# EAGLE design LINLCDV2 (EAGLE 9.5.2)
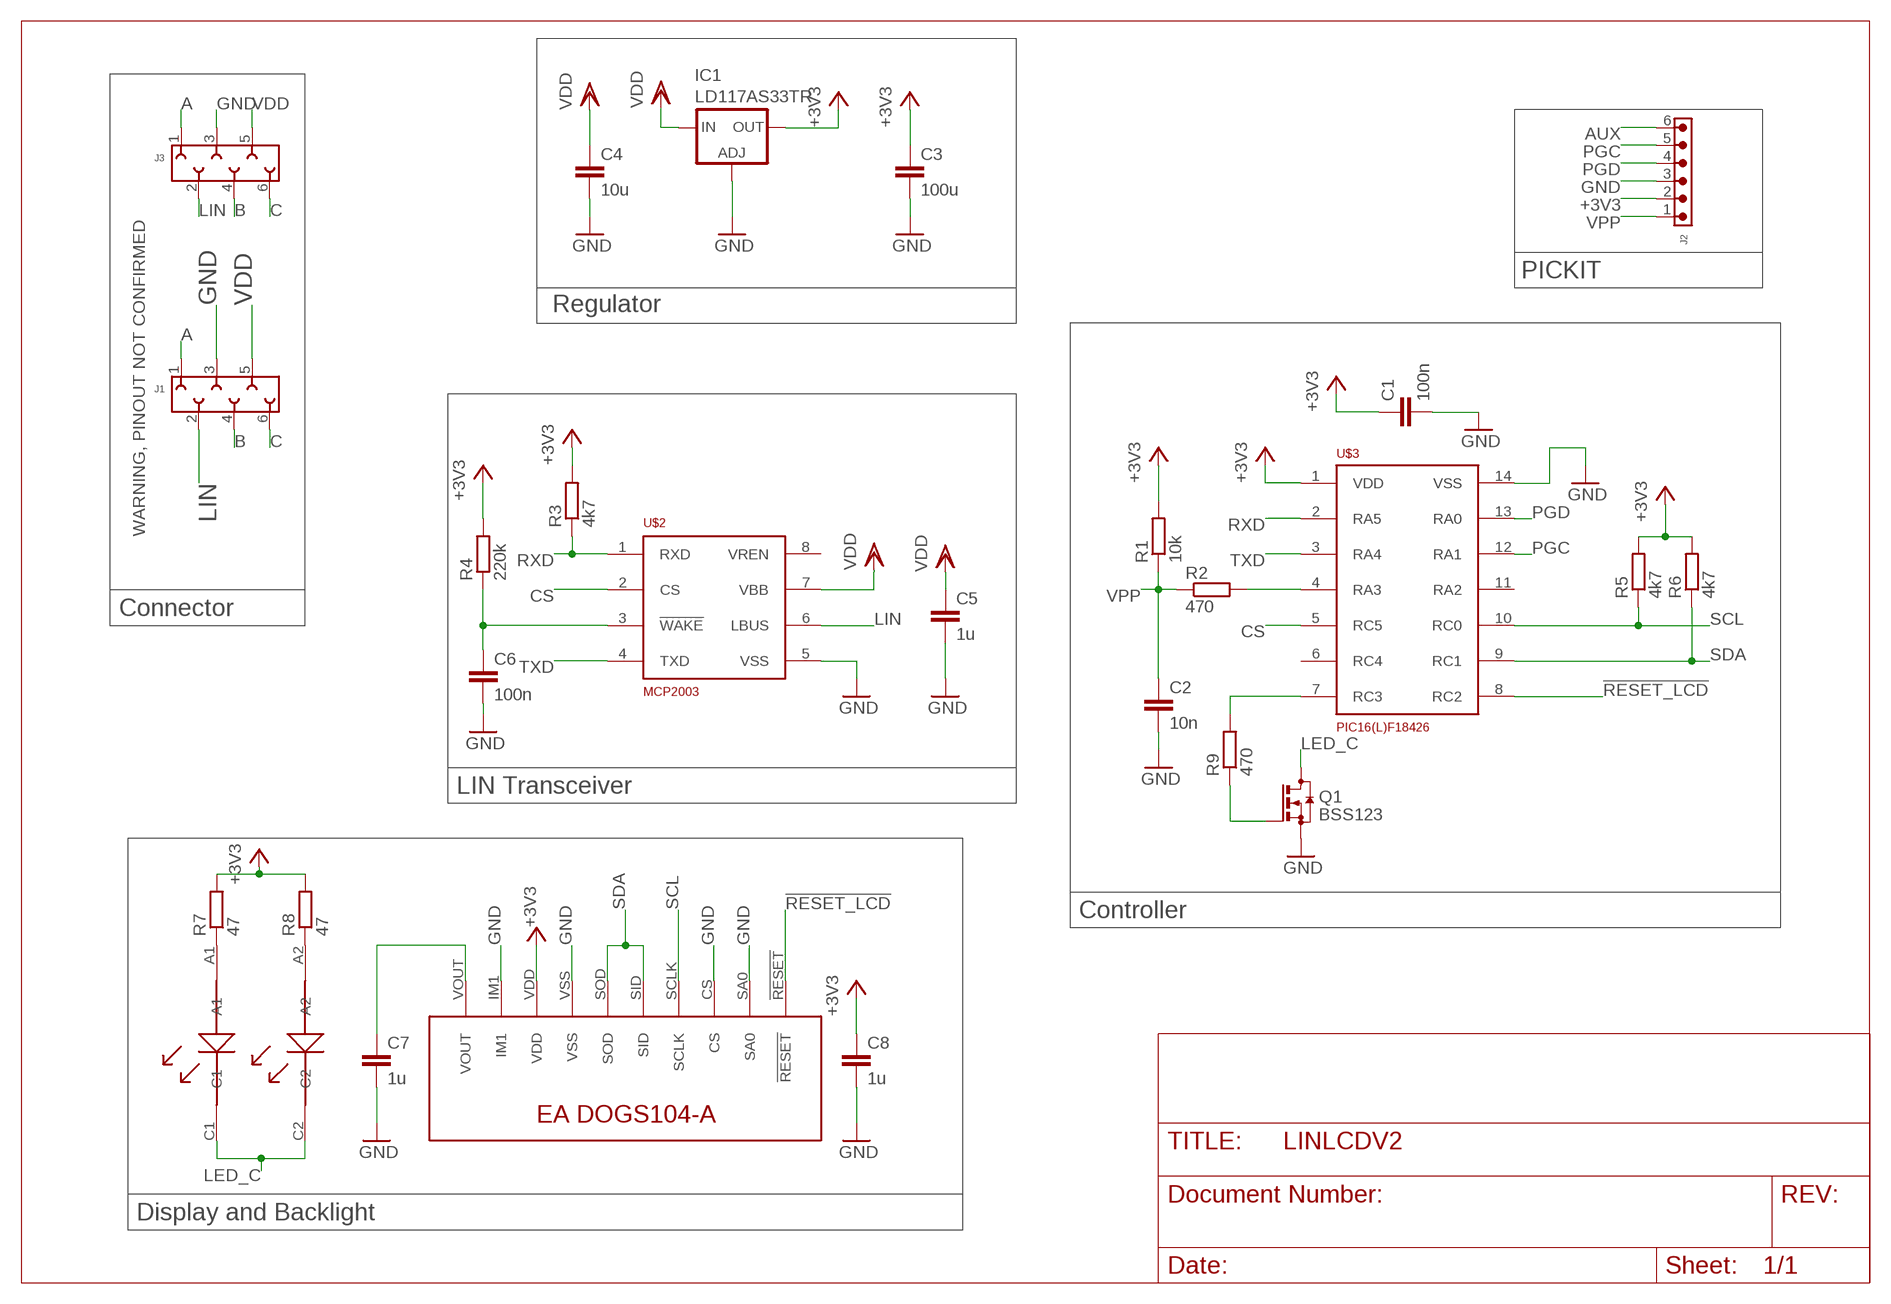
[diagram p0: schematic, sheet 1]

## Parts
C1  100n  C-EUC0603  [C0603]
C2  10n  C-EUC0603  [C0603]
C3  100u  C-EUC1206  [C1206]
C4  10u  C-EUC1206  [C1206]
C5  1u  C-EUC1206  [C1206]
C6  100n  C-EUC0603  [C0603]
C7  1u  C-EUC1206  [C1206]
C8  1u  C-EUC1206  [C1206]
IC1  LD117AS33TR  [SOT223]
J1  690367280676  [690367280676]
J2  6130XX11021_61300611021  [61300611021]
J3  690367280676  [690367280676]
Q1  BSS123  [SOT23]
R1  10k  R-EU_R0603  [R0603]
R2  470  R-EU_R0603  [R0603]
R3  4k7  R-EU_R0603  [R0603]
R4  220k  R-EU_R0603  [R0603]
R5  4k7  R-EU_R0603  [R0603]
R6  4k7  R-EU_R0603  [R0603]
R7  47  R-EU_R0603  [R0603]
R8  47  R-EU_R0603  [R0603]
R9  470  R-EU_R0603  [R0603]
U$1  DOGS104-A  [DOGS104-A]
U$2  MCP2003  [SO-08]
U$3  PIC16(L)F18426  [SO-14]

## Nets
!RESET_LCD: U$1.!RESET U$3.8(RC2)
+3V3: C1.1 C3.1 C8.1 IC1.4(OUT) J2.2 R1.2 R3.2 R4.2 R5.2 R6.2 R7.2 R8.2 U$1.VDD U$3.1(VDD)
A: J1.1 J3.1
AUX: J2.6
B: J1.4 J3.4
C: J1.6 J3.6
CS: U$2.2(CS) U$3.5(RC5)
GND: C1.2 C2.2 C3.2 C4.2 C5.2 C6.2 C7.2 C8.2 IC1.1(ADJ) J1.3 J2.3 J3.3 Q1.2(S) U$1.CS U$1.IM1 U$1.SA0 U$1.VSS U$2.5(VSS) U$3.14(VSS)
LED_C: Q1.3(D) U$1.C1 U$1.C2
LIN: J1.2 J3.2 U$2.6(LBUS)
N$8: R2.2 U$3.4(RA3)
N$10: C6.1 R4.1 U$2.3(!WAKE)
N$11: C7.1 U$1.VOUT
N$12: R7.1 U$1.A1
N$13: R8.1 U$1.A2
N$15: R9.2 U$3.7(RC3)
N$16: Q1.1(G) R9.1
PGC: J2.5 U$3.12(RA1)
PGD: J2.4 U$3.13(RA0)
RXD: R3.1 U$2.1(RXD) U$3.2(RA5)
SCL: R5.1 U$1.SCLK U$3.10(RC0)
SDA: R6.1 U$1.SID U$1.SOD U$3.9(RC1)
TXD: U$2.4(TXD) U$3.3(RA4)
VDD: C4.1 C5.1 IC1.3(IN) J1.5 J3.5 U$2.7(VBB)
VPP: C2.1 J2.1 R1.1 R2.1
Unconnected: U$2.8(VREN) U$3.6(RC4) U$3.11(RA2)

## Notes on the sheet
- PICKIT
- Regulator
- WARNING, PINOUT NOT CONFIRMED
- Connector
- LIN Transceiver
- Controller
- Display and Backlight

## Library data of the parts
C1-C8 = rcl:C-EU: CAPACITOR, European symbol; SPICEPREFIX: C
IC1 = v-reg:LD117A?*: Low drop fixed and adjustable positive voltage regulators 1 A Source: http://www.st.com/stonline/products/literature/ds/7194/ld1117axx.pdf
J1 J3 = Wurth_Connectors_WR-MM:690367280676: WR-MM Female SMT Connector with Polarization KIND PROPERTIES: Pitch 2.54 mm Quality Class25 Mating cycles Gender:Female MATERIAL PROPERTIES: Insulator Material:PA6T Insulator Flammability Rating UL94 V-0 Insulator Color:Red Contact Material :Phosphor Bronze Contact Plating :Mat Tin over Nickel Contact Type: Stamped GENERAL PROPERTIES: Operating Temperature:-40 °C up to +105 °C Compliance Lead free / RoHS ELECTRICAL PROPERTIES: IR 1:1.5 A Working Voltage 100 V (AC) Withstanding Voltage:500 V (AC) Contact Resistance: 10 mΩ Insulation Resistance:1000 MΩ PACKAGING PROPERTIES: cULus Approval:E323964 Packaging :Tape and Reel <https://katalog.we-online.com/media/images/v2/o58636v209%20Family_Female_SMT_ConnectorWPolarzation_WR-MM_69036728xx76.jpg> Details see:Web1: https://katalog.we-online.com/en/em/MM_1_27_SMT_FEMALE_CONNECTOR_WITH_POLARIZATION_69036728XX76_2 Web2: https://katalog.we-online.com/en/em/MM_1_27_SMT_FEMALE_CONNECTOR_WITH_POLARIZATION_69036728XX76 Updated by Yingchun,Shan 2019-10-28 2019 (C) Würth Elektronik; DATASHEET-URL: https://katalog.we-online.com/em/datasheet/690367280676.pdf; GENDER: Female; IR1: 1.5A; MATES: WR-MM Male Connector w/o Latch & w. Polarization/Male SMT Connector w/o Latch & w/o Polarization/Male IDC Connector; PACKAGING: Tape and Reel; PART-NUMBER: 690367280676; PINS: 6; TCP: per Row; TYPE: Straight
J2 = Wurth_Connectors_WR-PHD:6130XX11021_61300611021: WR-PHD 2.54 mm THT Angled Pin Header ARTICLE PROPERTIES: Pins:2;​ 3;​ 4;​ 5;​ 6;​ 7;​ 8;​ 9;​ 10;​ 12;​ 14;​ 16;​ 18;​ 22;​ 32;​ 34;​ 36;​ 40 KIND PROPERTIES: Pitch：2.54 mm Quality Class:3 as per CECC 75 301-802 Rows：Single Gender：Pin Header Type：Angled MATERIAL PROPERTIES: Insulator Material :PA6T Insulator Flammability Rating:UL94 V-0 Contact Material:Copper Alloy Contact Plating:Gold Contact Type:Stamped GENERAL INFORMATION Operating Temperature:-40 up to +105 °C Compliance:Lead free / RoHS ELECTRICAL PROPERTIES: Rated Current:3 A IR 1:3 A Withstanding Voltage:500 V (AC) Contact Resistance:20 mΩ RISO:1000 MΩ CERTIFICATION UL Approval:E323964 PACKAGING PROPERTIES Packaging:Bag <https://katalog.we-online.com/media/images/v2/o33210v209%20Family_WR-PHD_6130xx11021.jpg> Details see: https://katalog.we-online.com/en/em/PHD_2_54_THT_ANGLED_PIN_HEADER_6130XX11021 Updated by Yingchun,Shan 2019-10-16 2019 (C) Würth Elektronik; DATASHEET-URL: https://katalog.we-online.com/em/datasheet/61300611021.pdf; GENDER: Pin Header; IR: 3A; MATES: WR-PHD 2.5mm Angled Socket Header/SMT Socket Header/Socket Header/Soket Header Bottom Entry; PACKAGING: Bag; PART-NUMBER: 61300611021; PINS: 6; ROWS: Single; TYPE: Angled
Q1 = transistor-small-signal:BSS123: N-CHANNEL MOS FET
R1-R9 = rcl:R-EU_: RESISTOR, European symbol; SPICEPREFIX: R
U$1 = linlcd:DOGS104-A
U$2 = linlcd:MCP2003
U$3 = linlcd:PIC16(L)F18426

## Board
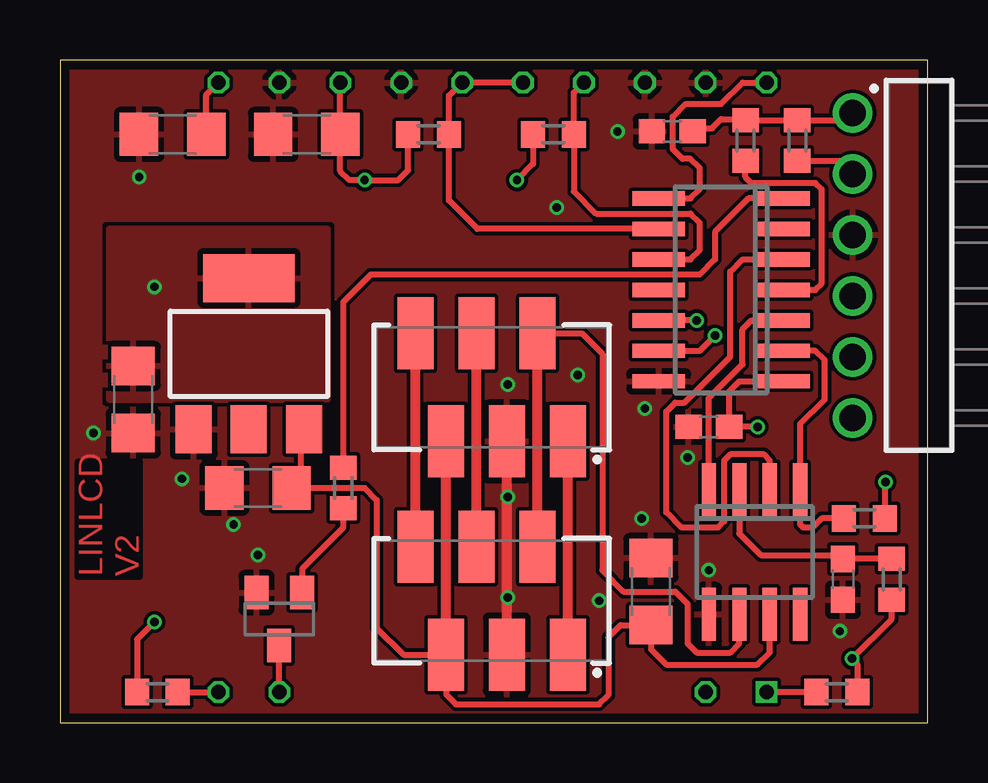
[diagram p1: board, top side]
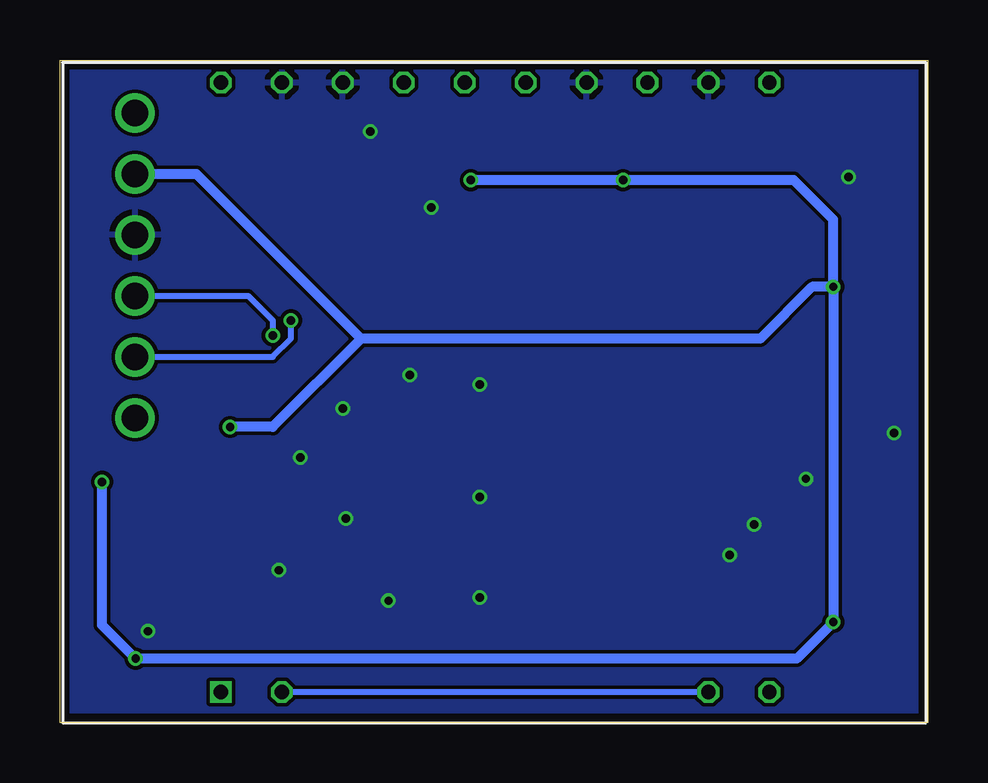
[diagram p2: board, bottom side, seen from below]

Size 36.17 x 27.61 mm. Coordinates in mm from the lower left corner, seen from the top.
Outline: 0,0 36.17,0 36.17,27.61 0,27.61 0,0
Copper layers (1*16): Top 0.035559375mm / dielectric 1.6mm / Bottom 0.035559375mm
Design rules "oshpark-2layer": minimum track width 6mil, minimum drill 10mil, track to track 6mil, track to pad 6mil, pad to pad 6mil, via to via 6mil, smd to smd 6mil, copper to edge 15mil, drill to drill 6mil, minimum pad ring 5mil, minimum via ring 5mil, stop-mask expansion 2.5mil, vias tented up to drill 0mil, thermal gap 10mil

### Footprints (pad centres in the part's own frame; a part is rotated, then mirrored left to right if it is on the bottom)
C0603 = smd 1.1 x 1: 1 -0.85,0; 2 0.85,0
C1206 = smd 1.6 x 1.8: 1 -1.4,0; 2 1.4,0
SOT223 = smd 1.5 x 2: 1 -2.3,-3.15; 2 0,-3.15; 3 2.3,-3.15 | smd 3.8 x 2: 4 0,3.15
690367280676 = smd 1.5 x 3: 1 -3.175,2.25; 2 -1.905,-2.25; 3 -0.635,2.25; 4 0.635,-2.25; 5 1.905,2.25; 6 3.175,-2.25
61300611021 = drill 1.1: 1 6.35,2.77; 2 3.81,2.77; 3 1.27,2.77; 4 -1.27,2.77; 5 -3.81,2.77; 6 -6.35,2.77
SOT23 = smd 1 x 1.4: 1 -0.95,-1.1; 2 0.95,-1.1; 3 0,1.1
R0603 = smd 1 x 1.1: 1 -0.85,0; 2 0.85,0
DOGS104-A = drill 0.6 octagon: !RESET 0,25.4; A2 22.86,0; C1 2.54,0; C2 20.32,0; CS 5.08,25.4; IM1 20.32,25.4; SA0 2.54,25.4; SCLK 7.62,25.4; SID 10.16,25.4; SOD 12.7,25.4; VDD 17.78,25.4; VOUT 22.86,25.4; VSS 15.24,25.4 | drill 0.6 square: A1 0,0
SO-08 = smd 0.6 x 2.2: 1 -1.905,-2.6; 2 -0.635,-2.6; 3 0.635,-2.6; 4 1.905,-2.6; 5 1.905,2.6; 6 0.635,2.6; 7 -0.635,2.6; 8 -1.905,2.6
SO-14 = smd 0.6 x 2.2: 1 -3.81,-2.6; 2 -2.54,-2.6; 3 -1.27,-2.6; 4 0,-2.6; 5 1.27,-2.6; 6 2.54,-2.6; 7 3.81,-2.6; 8 3.81,2.6; 9 2.54,2.6; 10 1.27,2.6; 11 0,2.6; 12 -1.27,2.6; 13 -2.54,2.6; 14 -3.81,2.6

### Placement (x,y rotation side)
C1  27.05,12.32 180 top
C2  25.53,24.64 180 top
C3  3.05,13.46 270 top
C4  8.26,9.78 180 top
C5  24.64,5.46 90 top
C6  32.64,5.97 270 top
C7  4.7,24.51 180 top
C8  10.29,24.51 180 top
IC1  7.87,15.37 0 top
J1  18,5.08 180 top
J2  35.81,19.05 90 top
J3  18,13.97 180 top
Q1  9.14,4.32 180 top
R1  30.73,24.26 270 top
R2  28.57,24.26 270 top
R3  33.53,8.51 0 top
R4  34.67,5.97 270 top
R5  20.57,24.51 180 top
R6  15.37,24.51 180 top
R7  32.38,1.27 0 top
R8  4.06,1.27 180 top
R9  11.81,9.78 90 top
U$1  29.46,1.27 0 bottom
U$2  28.96,7.11 180 top
U$3  27.56,18.03 90 top

### Tracks (layer width: path | path; a pad name or v marks a point on that pad's centre or on a via)
!RESET_LCD
  Top 0.254: U$1.!RESET 28.45,26.67 27.56,25.78 26.07,25.78 25.55,25.25 25.55,23.9 25.95,23.5 26.29,23.5 26.67,23.11 26.67,22.23 26.29,21.84 U$3.8
+3V3  (via drill 0.35)
  Top 0.254: U$1.VDD C8.1 11.69,22.98 12.06,22.61 v12.7,22.61 14.1,22.61 14.52,23.03 R6.2 | R5.2 19.72,23.28 v19.05,22.61 | v29.08,12.32 C1.1 27.9,13.8 28.32,14.22 U$3.1 | R1.2 32.5,23.41 J2.2 | v3.94,4.19 3.21,3.47 R8.2 | R7.2 33.23,2.45 v33.02,2.67 34.67,4.32 R4.2 | v34.42,10.03 34.38,9.99 R3.2
  Bottom 0.406: v3.94,18.16 3.94,20.95 5.59,22.61 v12.7,22.61 v19.05,22.61 | v3.94,18.16 v3.94,4.19 5.46,2.67 v33.02,2.67 34.42,4.06 v34.42,10.03 | v3.94,18.16 4.83,18.16 6.99,16 23.62,16 | v29.08,12.32 27.3,12.32 23.62,16 | J2.2 30.48,22.86 23.62,16
  pour Top: 2.03,13.46 11.18,13.46 11.18,20.57 2.03,20.57
A
  Top 0.406: J1.1 J3.1
B
  Top 0.406: J1.4 J3.4
C
  Top 0.406: J1.6 J3.6
CS
  Top 0.254: U$2.2 29.59,10.92 29.34,11.18 27.94,11.18 27.69,10.92 27.69,8.38 27.43,8.13 25.91,8.13 25.27,8.76 25.27,12.95 25.65,13.34 26.04,13.34 27.94,15.24 27.94,18.8 28.45,19.3 U$3.5
GND  (via drill 0.35)
  Top 0.406: J1.3 J3.3
  other vias: 3.3,22.73 20.7,21.46 23.24,24.64 24.38,13.08 26.16,11.05 24.26,8.51 21.59,14.48 22.48,5.08 27.05,6.35 32.51,3.81 8.26,6.99 7.24,8.26 1.4,12.06 5.08,10.16 18.67,5.21 18.67,9.4 18.67,14.1
  pour Top (rank 6): -1.27,31.75 -1.27,-1.27 40.64,-1.27 40.64,31.75
  pour Bottom (rank 6): -2.54,33.02 -2.54,-2.54 41.91,-2.54 41.91,33.02
LED_C
  Top 0.254: U$1.C2 Q1.3
  Bottom 0.254: U$1.C2 U$1.C1
LIN
  Top 0.254: J3.2 21.75,16.22 22.61,15.37 22.61,6.35 23.5,5.46 25.65,5.46 26.16,4.95 26.16,3.3 26.54,2.92 27.94,2.92 28.32,3.3 U$2.6
  Top 0.406: J1.2 J3.2
N$8
  Top 0.254: U$3.4 31.5,18.03 31.75,18.29 31.75,22.23 31.5,22.48 28.83,22.48 28.57,22.73 R2.2
N$10
  Top 0.254: R4.1 C6.1 32.47,6.99 29.21,6.99 28.32,7.87 U$2.3
N$11
  Top 0.254: C7.1 6.1,26.16 U$1.VOUT
N$12
  Top 0.254: R7.1 U$1.A1
N$13
  Top 0.254: R8.1 U$1.A2
N$15
  Top 0.254: U$3.7 28.7,21.84 27.3,20.45 27.3,19.3 26.67,18.67 12.95,18.67 11.81,17.53 R9.2
N$16
  Top 0.254: R9.1 11.81,8.13 10.09,6.41 Q1.1
PGC  (via drill 0.35)
  Top 0.254: v26.54,16.76 U$3.12
  Bottom 0.254: J2.5 27.3,15.24 26.54,16 v26.54,16.76
PGD  (via drill 0.35)
  Top 0.254: U$3.13 26.67,15.49 v27.3,16.13
  Bottom 0.254: J2.4 28.32,17.78 27.3,16.76 v27.3,16.13
RXD
  Top 0.254: U$3.2 31.5,15.49 31.88,15.11 31.88,13.46 30.86,12.45 U$2.1 30.86,8.26 30.99,8.13 31.37,8.13 31.75,8.51 R3.1
SCL
  Top 0.254: U$1.SCLK 21.42,26.25 R5.1 21.42,22.14 22.35,21.21 26.29,21.21 26.67,20.83 26.67,19.68 26.29,19.3 U$3.10
SDA
  Top 0.254: U$1.SID U$1.SOD 16.22,26.12 R6.1 16.22,21.76 17.4,20.57 U$3.9
TXD
  Top 0.254: U$2.4 27.05,13.53 28.45,14.93 28.45,16.38 28.83,16.76 U$3.3
VDD
  Top 0.254: IC1.3 10.04,12.08 10.04,10.16 C4.1 12.7,9.78 13.21,9.27 13.21,3.94 14.31,2.83 J1.5 16.09,1.18 16.51,0.76 22.48,0.76 22.86,1.14 22.86,3.55 23.37,4.06 C5.1 24.64,3.05 25.27,2.41 29.08,2.41 29.59,2.92 U$2.7
  Top 0.406: J1.5 J3.5
VPP
  Top 0.254: C2.1 26.5,24.77 27.18,24.77 27.56,25.15 28.54,25.15 R2.1 R1.1 32.75,25.11 J2.1

### Text on the board
Top: LINLCD / V2
tStop: Pascal Schwarz | LINLCD / V2